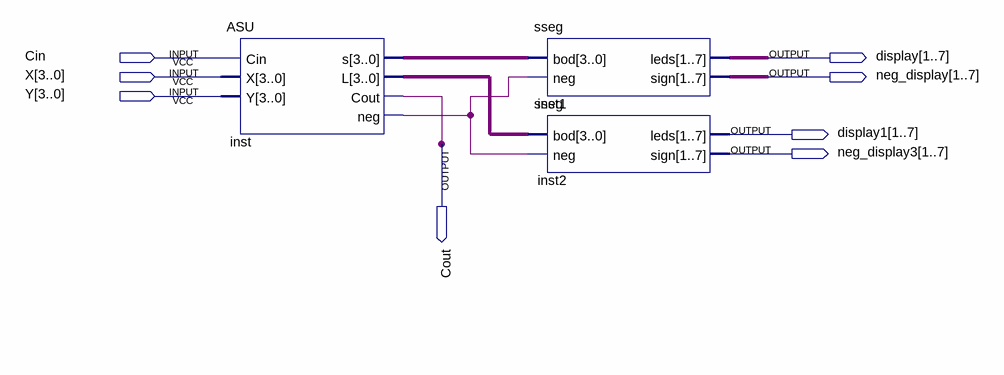
[diagram p0: schematic sheet]
// Quartus schematic CombineASU1.bdf as structural Verilog: 3 symbols, 8 pins
module CombineASU1 (
  input  Cin,
  input  [3:0] X,
  input  [3:0] Y,
  output [1:7] display,
  output [1:7] neg_display,
  output [1:7] display1,
  output Cout,
  output [1:7] neg_display3
);

  wire inst_neg;
  wire [3:0] inst_l, inst_s;

  ASU inst (.Cin(Cin), .X(X), .Y(Y), .s(inst_s), .L(inst_l), .Cout(Cout), .neg(inst_neg));
  sseg inst1 (.bod(inst_s), .neg(inst_neg), .leds(display), .sign(neg_display));
  sseg inst2 (.bod(inst_l), .neg(inst_neg), .leds(display1), .sign(neg_display3));
endmodule
